# EAGLE design NE556-CD4069-Synth-Toy-CableConn (EAGLE 7.2.0)
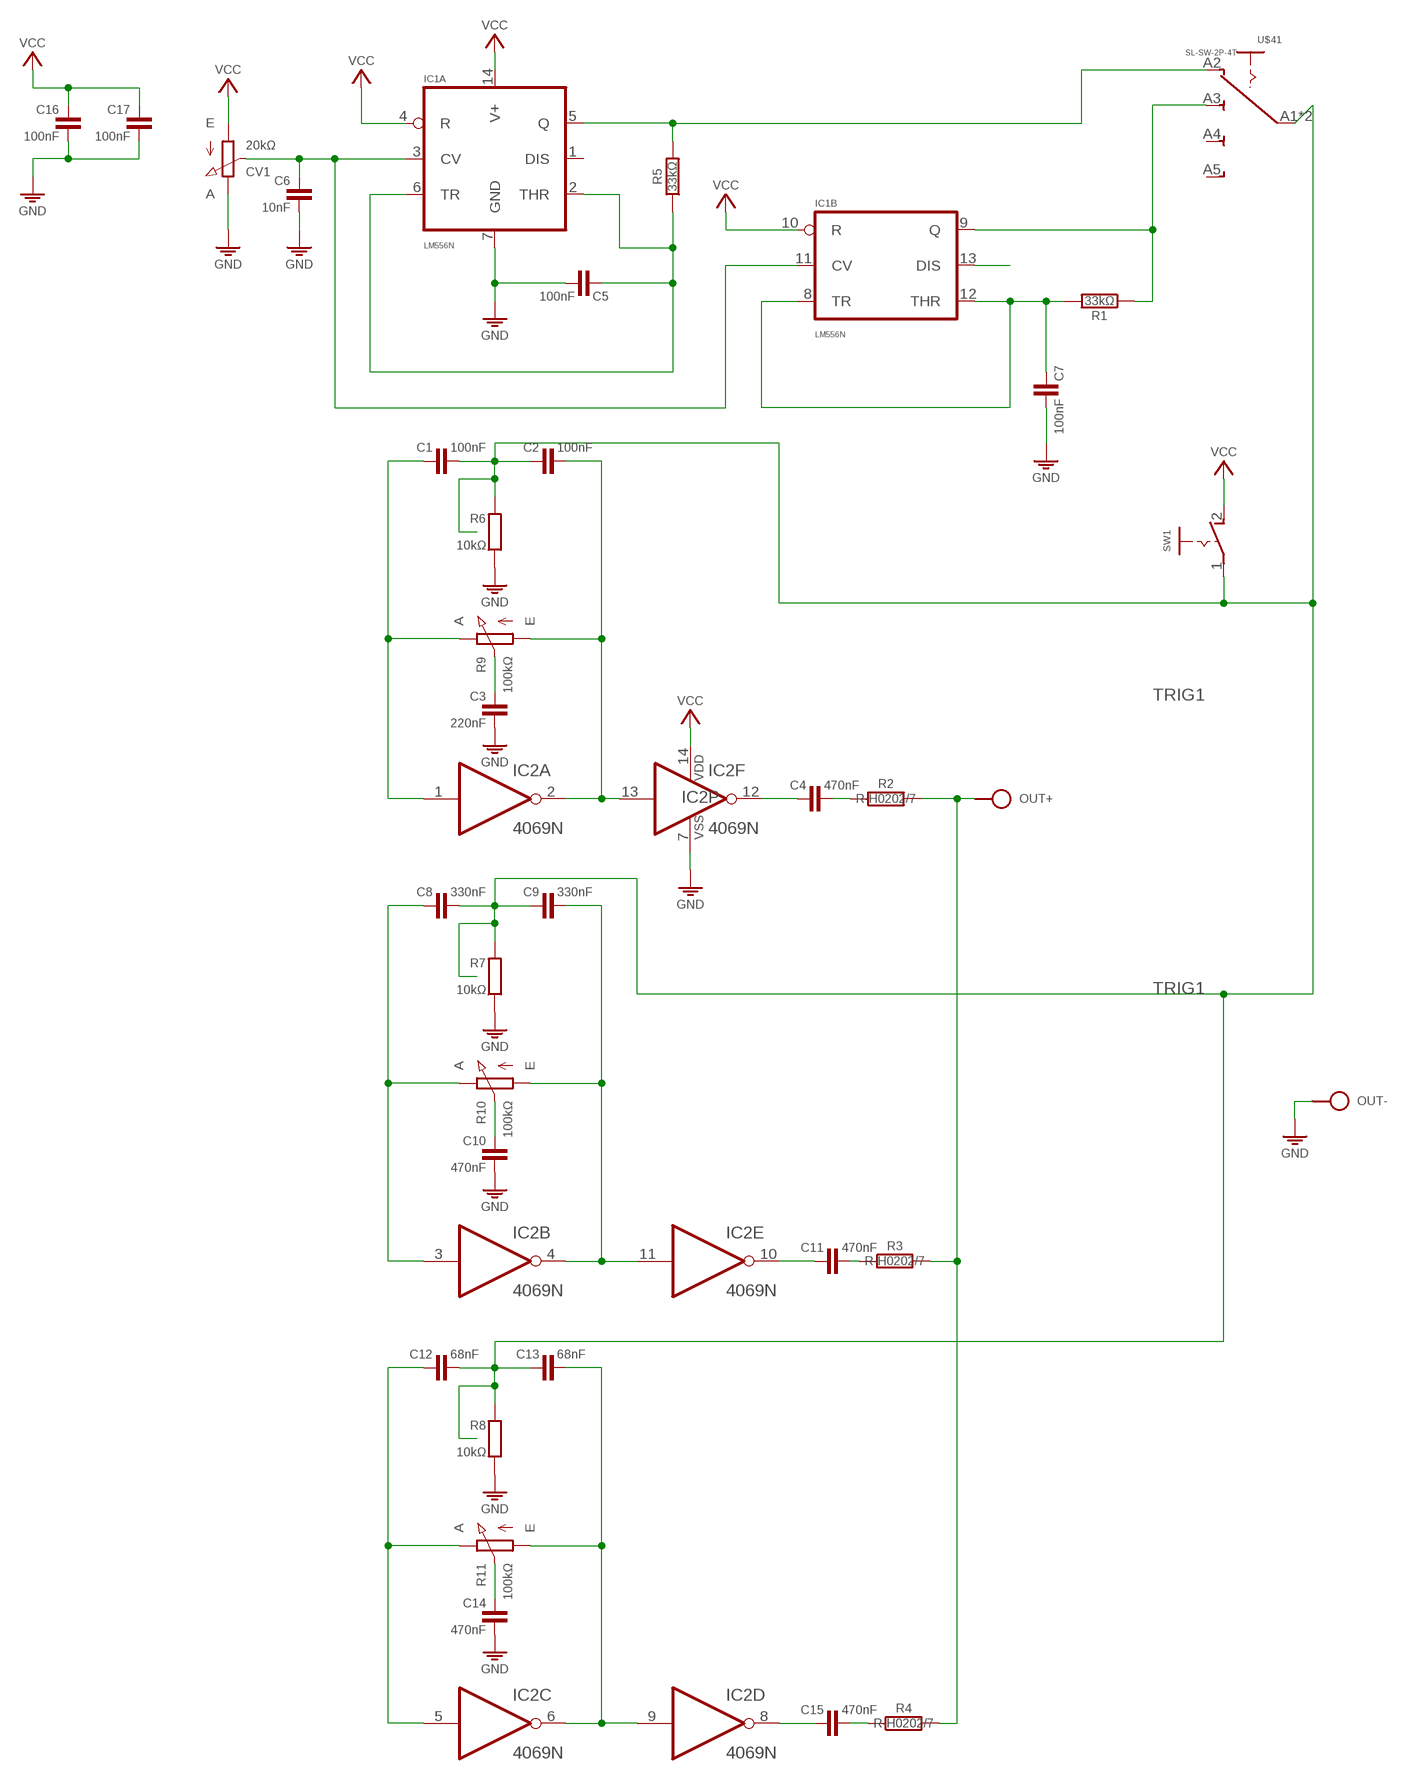
[diagram p0: schematic, sheet 1]

## Parts
C1  100nF  C-H050-020X044  [C050-020X044]
C2  100nF  C-H050-020X044  [C050-020X044]
C3  220nF  C050-020X044/V  [C050-020X044/V]
C4  470nF  C-H050-024X044  [C050-024X044]
C5  100nF  C-H050-020X044  [C050-020X044]
C6  10nF  C050-020X044/V  [C050-020X044/V]
C7  100nF  C-H050-020X044  [C050-020X044]
C8  330nF  C-H050-024X044  [C050-024X044]
C9  330nF  C-H050-024X044  [C050-024X044]
C10  470nF  C050-020X044/V  [C050-020X044/V]
C11  470nF  C-H050-024X044  [C050-024X044]
C12  68nF  C-H050-020X044  [C050-020X044]
C13  68nF  C-H050-020X044  [C050-020X044]
C14  470nF  C050-020X044/V  [C050-020X044/V]
C15  470nF  C-H050-024X044  [C050-024X044]
C16  100nF  C050-020X044/V  [C050-020X044/V]
C17  100nF  C050-020X044/V  [C050-020X044/V]
CV1  20kΩ  POT-3P  [CONN-3P]
IC1  LM556N  [DIL14]
IC2  4069N  [DIL14]
OUT  SPAD+--+  [SPAD-+]
R1  33kΩ  R-H0204/2V  [0204/2V]
R2  R-H0202/7  [0202/7]
R3  R-H0202/7  [0202/7]
R4  R-H0202/7  [0202/7]
R5  33kΩ  R-H0204/2V  [0204/2V]
R6  10kΩ  R0204/10-V  [0204/10-V]
R7  10kΩ  R0204/10-V  [0204/10-V]
R8  10kΩ  R0204/10-V  [0204/10-V]
R9  100kΩ  POT-3P-S1  [CONN-3P]
R10  100kΩ  POT-3P-S1  [CONN-3P]
R11  100kΩ  POT-3P-S1  [CONN-3P]
S3  VCC_GNDPWR-L  [PWR-L]
SW1  PB-1P-1T  [PB-1P1T]
U$4  SL-SW-2P-4T  [SLSW-2P4T-2-H]

## Nets
GND: C3.2 C5.2 C6.2 C7.2 C10.2 C14.2 C16.2 C17.2 CV1.3(E) IC1.7(A:GND) IC2.7(P:VSS) OUT.1 R6.2 R7.2 R8.2 S3.1
N$1: C2.2 IC2.2(A:O) IC2.13(F:I) R9.2(A)
N$2: IC1.5(A:Q) R5.2 U$4.A2(1:A)
N$3: C4.2 R2.1
N$4: C3.1 R9.1(S)
N$5: C14.1 R11.1(S)
N$6: C4.1 IC2.12(F:O)
N$7: C1.1 IC2.1(A:I) R9.3(E)
N$8: C5.1 IC1.2(A:THR) IC1.6(A:TR) R5.1
N$9: C6.1 CV1.2(S) IC1.3(A:CV) IC1.11(B:CV)
N$10: C12.1 IC2.5(C:I) R11.3(E)
N$11: IC1.9(B:Q) R1.1 U$4.A3(1:B)
N$12: C7.1 IC1.8(B:TR) IC1.12(B:THR) R1.2
N$14: C8.1 IC2.3(B:I) R10.3(E)
N$15: C13.2 IC2.6(C:O) IC2.9(D:I) R11.2(A)
N$16: C15.1 IC2.8(D:O)
N$17: C11.2 R3.1
N$18: C11.1 IC2.10(E:O)
N$19: OUT.2 R2.2 R3.2 R4.2
N$20: C9.2 IC2.4(B:O) IC2.11(E:I) R10.2(A)
N$21: C15.2 R4.1
N$22: C10.1 R10.1(S)
NC_1: IC1.13(B:DIS)
TRIG1: C1.2 C2.1 C8.2 C9.1 C12.2 C13.1 R6.1 R7.1 R8.1 SW1.1(P) U$4.A1(1:P) U$4.A6(1:P)
VCC: C16.1 C17.1 CV1.1(A) IC1.4(A:R) IC1.10(B:R) IC1.14(A:V+) IC2.14(P:VDD) S3.2 SW1.2(S)
Unconnected: IC1.1(A:DIS) U$4.A4(1:C) U$4.A5(1:D) U$4.B1(2:P) U$4.B2(2:A) U$4.B3(2:B) U$4.B4(2:C) U$4.B5(2:D) U$4.B6(2:P)

## Library data of the parts
C1 C2 C4 C5 C7-C9 C11-C13 C15 = c:C-H
C3 C6 C10 C14 C16 C17 = c:C: CAPACITOR, European symbol
CV1 R9-R11 = r:POT
IC1 = ic:*556: Dual Timer http://www.ti.com/lit/ds/symlink/lm556.pdf
IC2 = ic:4069: Hex INVERTER
OUT = pad:SPAD+-
R1-R5 = r:R-H
R6-R8 = r:R: RESISTOR, European symbol
S3 = pad:VCC_GND
SW1 = sw:PB-1P-1T
U$4 = sw:SL-SW-2P-4T

## Net classes
0 default: width 0.61 mm

## Board
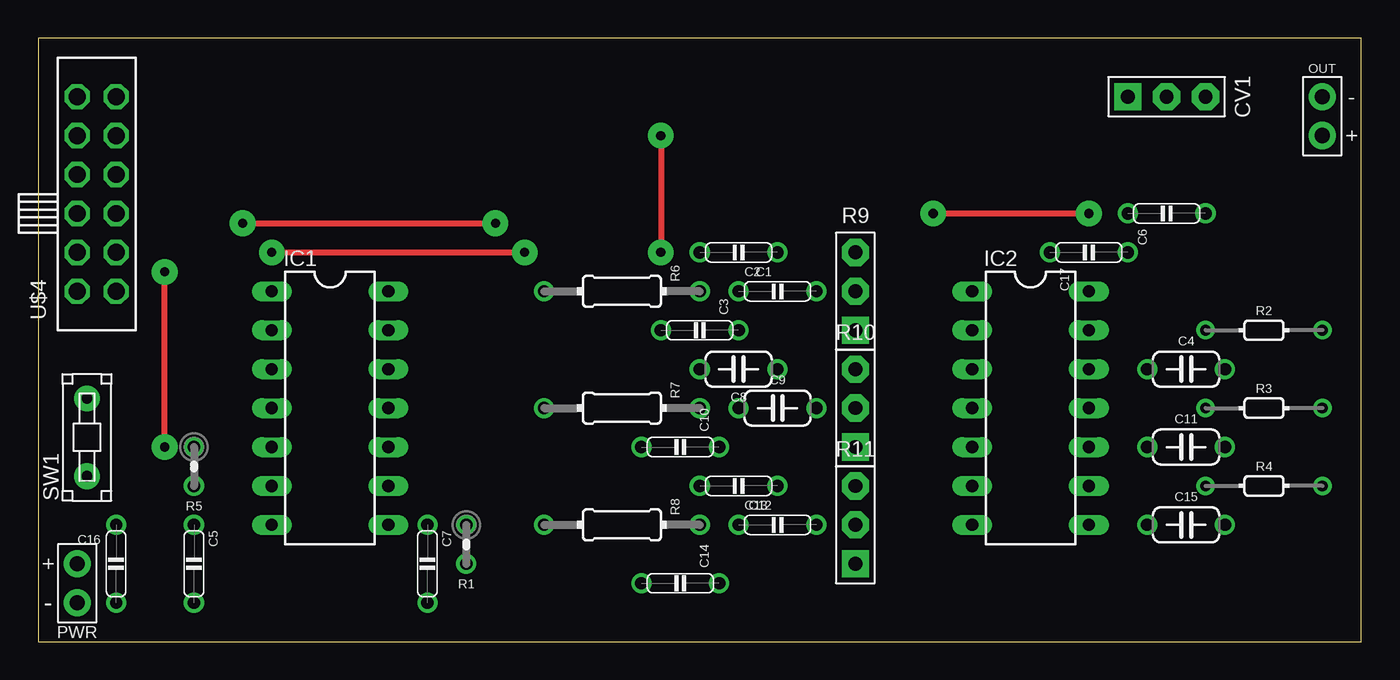
[diagram p1: board, top side]
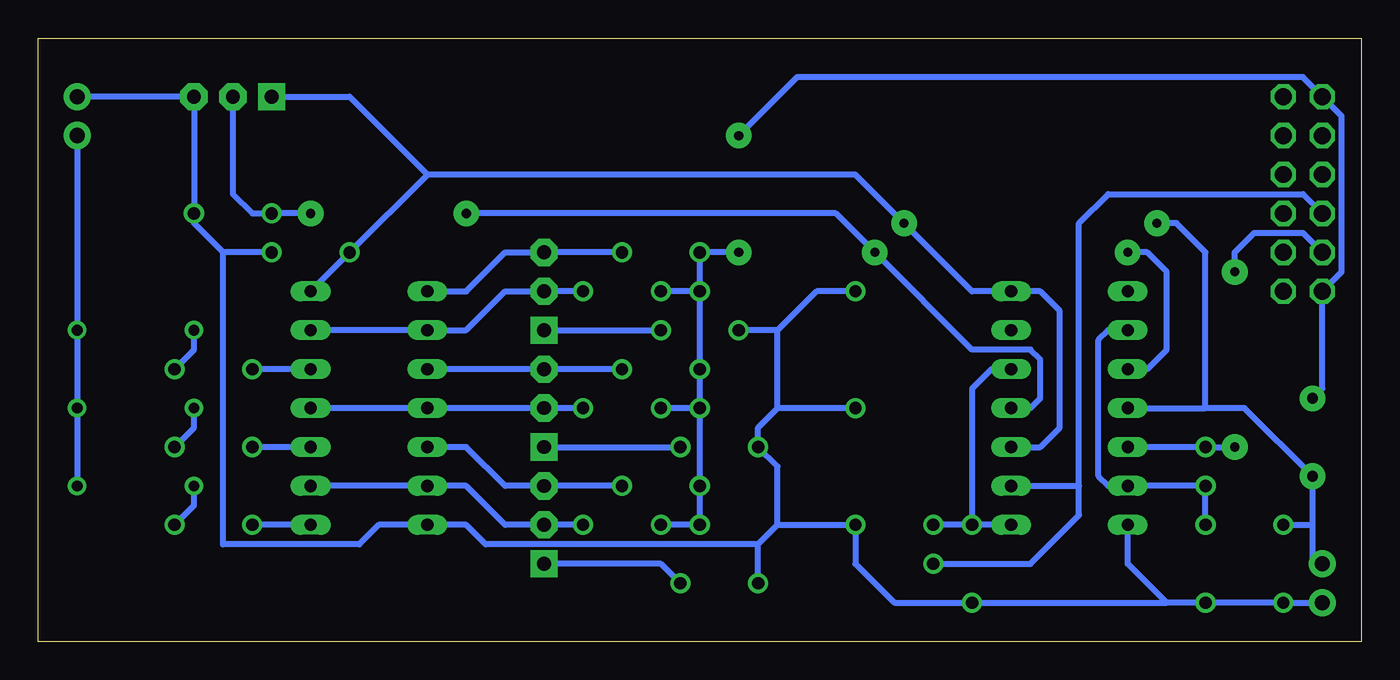
[diagram p2: board, bottom side, seen from below]

Size 86.36 x 39.37 mm. Coordinates in mm from the lower left corner, seen from the top.
Outline: 0,0 86.36,0 86.36,39.37 0,39.37 0,0
Copper layers (1*16): Top 0.035mm / dielectric 1.5mm / Bottom 0.035mm
Design rules "default": minimum track width 10mil, minimum drill 24mil, track to track 8mil, track to pad 8mil, pad to pad 8mil, via to via 8mil, smd to smd 8mil, copper to edge 40mil, drill to drill 8mil, minimum pad ring 10mil, minimum via ring 8mil, stop-mask expansion 4mil, vias tented up to drill 0mil, thermal gap 10mil

### Footprints (pad centres in the part's own frame; a part is rotated, then mirrored left to right if it is on the bottom)
C050-020X044 = drill 0.8: 1 -2.54,0; 2 2.54,0
C050-020X044/V = drill 0.8: 1 0,2.54; 2 0,-2.54
C050-024X044 = drill 0.8: 1 -2.54,0; 2 2.54,0
CONN-3P = drill 0.9 pad 1.778 square: 1 0,-2.54 | drill 0.9 pad 1.778 octagon: 2 0,0; 3 0,2.54
DIL14 = drill 0.8 long: 1 -3.81,7.62; 2 -3.81,5.08; 3 -3.81,2.54; 4 -3.81,0; 5 -3.81,-2.54; 6 -3.81,-5.08; 7 -3.81,-7.62; 8 3.81,-7.62; 9 3.81,-5.08; 10 3.81,-2.54; 11 3.81,0; 12 3.81,2.54; 13 3.81,5.08; 14 3.81,7.62
SPAD-+ = drill 1 pad 1.778: 1 0,-1.27; 2 0,1.27
0204/2V = drill 0.8: 1 0,1.27; 2 0,-1.27
0202/7 = drill 0.7: 1 -3.81,0; 2 3.81,0
0204/10-V = drill 0.8: 1 0,5.08; 2 0,-5.08
PWR-L = drill 1 pad 1.778: 1 0,-1.27; 2 0,1.27
PB-1P1T = drill 0.7 pad 1.676: 1 2.54,0; 2 -2.54,0
SLSW-2P4T-2-H = drill 1.1 pad 1.524 octagon: A1 -6.35,1.27; A2 -3.81,1.27; A3 -1.27,1.27; A4 1.27,1.27; A5 3.81,1.27; A6 6.35,1.27; B1 -6.35,-1.27; B2 -3.81,-1.27; B3 -1.27,-1.27; B4 1.27,-1.27; B5 3.81,-1.27; B6 6.35,-1.27

### Placement (x,y rotation side)
C1  45.72,25.4 180 top
C2  48.26,22.86 0 top
C3  43.18,20.32 270 top
C4  74.93,17.78 0 top
C5  10.16,5.08 270 top
C6  73.66,27.94 90 top
C7  25.4,5.08 270 top
C8  45.72,17.78 180 top
C9  48.26,15.24 0 top
C10  41.91,12.7 270 top
C11  74.93,12.7 0 top
C12  45.72,10.16 180 top
C13  48.26,7.62 0 top
C14  41.91,3.81 270 top
C15  74.93,7.62 0 top
C16  5.08,5.08 0 top
C17  68.58,25.4 90 top
CV1  73.66,35.56 270 top
IC1  19.05,15.24 0 top
IC2  64.77,15.24 0 top
OUT  83.82,34.29 180 top
R1  27.94,6.35 180 top
R2  80.01,20.32 0 top
R3  80.01,15.24 0 top
R4  80.01,10.16 0 top
R5  10.16,11.43 180 top
R6  38.1,22.86 270 top
R7  38.1,15.24 270 top
R8  38.1,7.62 270 top
R9  53.34,22.86 0 top
R10  53.34,15.24 0 top
R11  53.34,7.62 0 top
S3  2.54,3.81 0 top
SW1  3.17,13.34 90 top
U$4  3.81,29.21 90 top

### Tracks (layer width: path | path; a pad name or v marks a point on that pad's centre or on a via)
GND
  Bottom 0.406: 39.37,6.35 57.15,6.35 58.42,7.62 IC2.7 64.14,7.62 65.41,6.35 74.3,6.35 74.3,25.4 | C14.2 39.37,6.35 | 38.1,7.62 R8.2 33.02,5.08 30.48,2.54 C7.2 12.7,2.54 | R6.2 35.56,22.86 38.1,20.32 | 38.1,20.32 C3.2 | OUT.1 CV1.3 C6.2 76.2,27.3 74.3,25.4 | C17.2 74.3,25.4 | 39.37,6.35 38.1,7.62 | 38.1,7.62 38.1,11.43 C10.2 39.37,13.97 38.1,15.24 | 12.7,2.54 C5.2 C16.2 S3.1 | 12.7,2.54 15.24,5.08 IC1.7 | R7.2 38.1,15.24 | 38.1,15.24 38.1,20.32
N$1
  Bottom 0.406: IC2.13 IC2.2 58.42,20.32 55.88,22.86 R9.2 C2.2
N$2  (via drill 0.6 pad 1.68)
  Top 0.406: v8.26,12.7 v8.26,24.13
  Bottom 0.406: IC1.5 R5.2 v8.26,12.7 | v8.26,24.13 8.26,25.4 6.99,26.67 3.81,26.67 U$4.A2
N$3
  Bottom 0.406: C4.2 76.2,19.05 R2.1
N$4
  Bottom 0.406: R9.1 C3.1
N$5
  Bottom 0.406: C14.1 45.72,5.08 R11.1
N$6
  Bottom 0.406: IC2.12 C4.1
N$7
  Bottom 0.406: IC2.1 58.42,22.86 55.88,25.4 R9.3 C1.1
N$8
  Bottom 0.406: C5.1 R5.1 IC1.6 16.51,10.16 17.14,10.79 17.14,19.68 16.51,20.32 IC1.2
N$9  (via drill 0.6 pad 1.68)
  Top 0.406: v15.24,25.4 v31.75,25.4 | v58.42,27.94 v68.58,27.94
  Bottom 0.406: CV1.2 73.66,29.21 72.39,27.94 C6.1 v68.58,27.94 | IC1.11 21.59,15.24 20.95,15.88 20.95,18.41 21.59,19.05 25.4,19.05 v31.75,25.4 34.29,27.94 v58.42,27.94 | IC1.3 13.97,17.78 12.7,19.05 12.7,24.13 13.97,25.4 v15.24,25.4
N$10
  Bottom 0.406: IC2.5 58.42,12.7 55.88,10.16 R11.3 C12.1
N$11
  Bottom 0.406: R1.1 21.59,5.08 18.41,8.26 18.41,10.16 | IC1.9 18.41,10.16 | 18.41,10.16 18.41,27.3 16.51,29.21 3.81,29.21 U$4.A3
N$12
  Bottom 0.406: IC1.12 24.13,17.78 25.4,16.51 C7.1 | IC1.8 C7.1 | C7.1 R1.2
N$14
  Bottom 0.406: C8.1 R10.3 IC2.3
N$15
  Bottom 0.406: C13.2 R11.2 55.88,7.62 58.42,10.16 IC2.6 IC2.9
N$16
  Bottom 0.406: IC2.8 C15.1
N$17
  Bottom 0.406: C11.2 76.2,13.97 R3.1
N$18
  Bottom 0.406: IC2.10 C11.1
N$19
  Bottom 0.406: OUT.2 R2.2 R3.2 R4.2
N$20
  Bottom 0.406: C9.2 R10.2 IC2.4 IC2.11
N$21
  Bottom 0.406: C15.2 76.2,8.89 R4.1
N$22
  Bottom 0.406: R10.1 C10.1
TRIG1  (via drill 0.6 pad 1.68)
  Top 0.406: v40.64,33.02 v40.64,25.4
  Bottom 0.406: R7.1 C12.2 R8.1 C13.1 | R6.1 C8.2 R7.1 | R7.1 C9.1 | R6.1 C2.1 | R6.1 C1.2 v40.64,25.4 | SW1.1 2.54,16.51 U$4.A1 1.27,24.13 1.27,34.29 U$4.A6 3.81,36.83 36.83,36.83 v40.64,33.02
VCC  (via drill 0.6 pad 1.68)
  Top 0.406: v13.34,27.3 v29.84,27.3
  Bottom 0.406: 60.96,30.48 33.02,30.48 v29.84,27.3 25.4,22.86 IC1.14 20.95,22.86 19.68,21.59 19.68,13.97 20.95,12.7 IC1.10 | 60.96,30.48 C17.1 IC2.14 | S3.2 3.17,5.08 3.17,7.62 | C16.1 3.17,7.62 | 3.17,7.62 SW1.2 7.62,15.24 10.16,15.24 | IC1.4 10.16,15.24 | 10.16,15.24 10.16,25.4 12.06,27.3 v13.34,27.3 | CV1.1 66.04,35.56 60.96,30.48